# EAGLE design board (EAGLE 6.4)
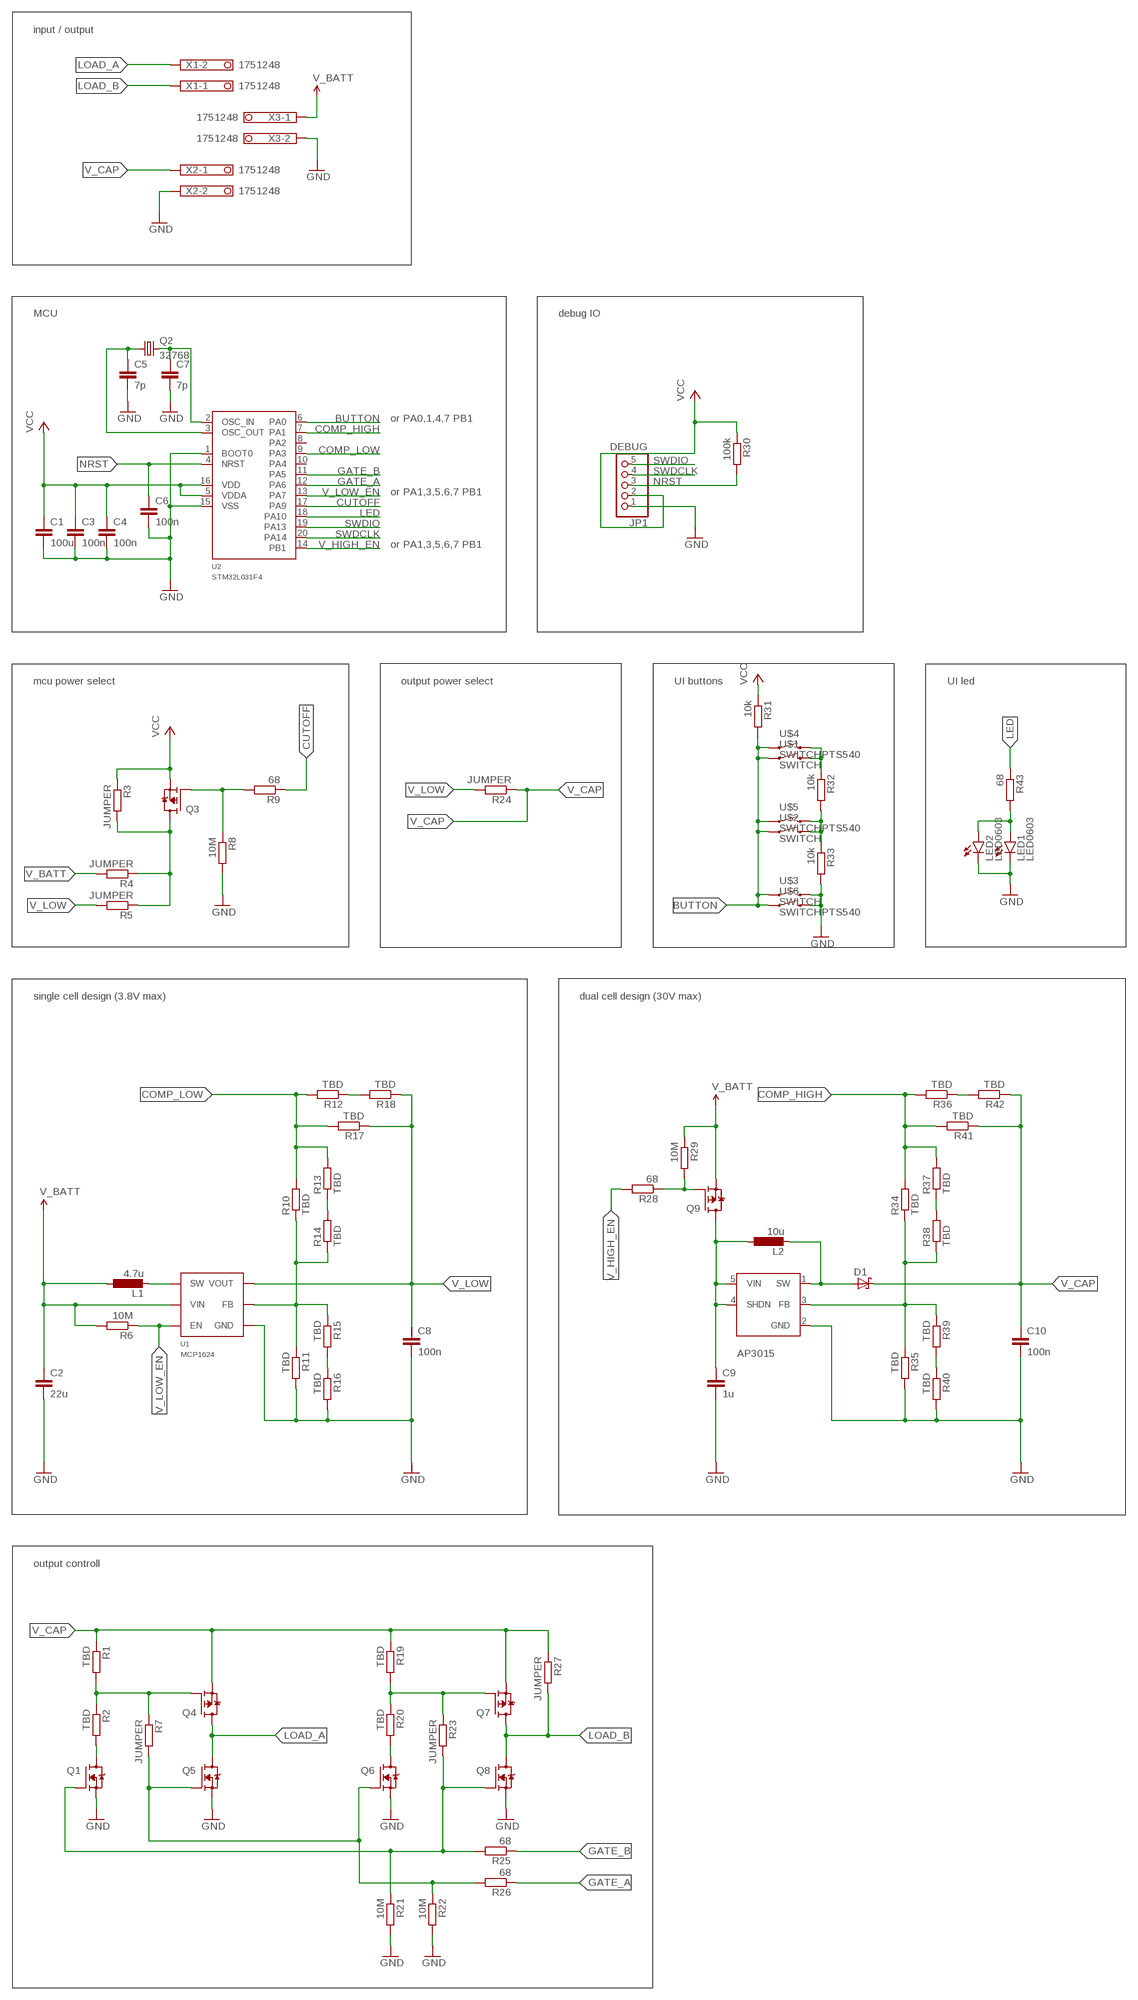
[diagram p0: schematic, sheet 1]

## Parts
C1  100u  CAPACITOR1206  [1206-SMALL]
C2  22u  CAPACITOR0805  [0805-SMALL]
C3  100n  CAPACITOR0603  [0603-SMALL]
C4  100n  CAPACITOR0603  [0603-SMALL]
C5  7p  C-EU0603-SAMLL  [0603-SMALL]
C6  100n  CAPACITOR0603  [0603-SMALL]
C7  7p  C-EU0603-SAMLL  [0603-SMALL]
C8  100n  CAPACITOR0603  [0603-SMALL]
C9  1u  CAPACITOR0805  [0805-SMALL]
C10  100n  CAPACITOR0603  [0603-SMALL]
D1  SCHOTTKY  [DO-214]
JP1  DEBUG  PINHD-1X05_2.54-S  [1X05-S]
L1  4.7u  INDUCTORSRN2510F  [SRN2510F]
L2  10u  INDUCTOR74404043100A  [74404043100A]
LED1  LED0603  [0603-SMALL]
LED2  LED0603  [0603-SMALL]
Q1  NFETGENERIC  [SOT23]
Q2  32768  ABS07  [ABS07]
Q3  PFETIRLML6401  [SOT23]
Q4  PFETIRLML6401  [SOT23]
Q5  NFETGENERIC  [SOT23]
Q6  NFETGENERIC  [SOT23]
Q7  PFETIRLML6401  [SOT23]
Q8  NFETGENERIC  [SOT23]
Q9  PFETIRLML6401  [SOT23]
R1  TBD  RESISTOR0603  [0603-SMALL]
R2  TBD  RESISTOR0603  [0603-SMALL]
R3  JUMPER  RESISTOR0603  [0603-SMALL]
R4  JUMPER  RESISTOR0603  [0603-SMALL]
R5  JUMPER  RESISTOR0603  [0603-SMALL]
R6  10M  RESISTOR0603  [0603-SMALL]
R7  JUMPER  RESISTOR0603  [0603-SMALL]
R8  10M  RESISTOR0603  [0603-SMALL]
R9  68  RESISTOR0603  [0603-SMALL]
R10  TBD  RESISTOR0603  [0603-SMALL]
R11  TBD  RESISTOR0603  [0603-SMALL]
R12  TBD  RESISTOR0603  [0603-SMALL]
R13  TBD  RESISTOR0603  [0603-SMALL]
R14  TBD  RESISTOR0603  [0603-SMALL]
R15  TBD  RESISTOR0603  [0603-SMALL]
R16  TBD  RESISTOR0603  [0603-SMALL]
R17  TBD  RESISTOR0603  [0603-SMALL]
R18  TBD  RESISTOR0603  [0603-SMALL]
R19  TBD  RESISTOR0603  [0603-SMALL]
R20  TBD  RESISTOR0603  [0603-SMALL]
R21  10M  RESISTOR0603  [0603-SMALL]
R22  10M  RESISTOR0603  [0603-SMALL]
R23  JUMPER  RESISTOR0603  [0603-SMALL]
R24  JUMPER  RESISTOR0603  [0603-SMALL]
R25  68  RESISTOR0603  [0603-SMALL]
R26  68  RESISTOR0603  [0603-SMALL]
R27  JUMPER  RESISTOR0603  [0603-SMALL]
R28  68  RESISTOR0603  [0603-SMALL]
R29  10M  RESISTOR0603  [0603-SMALL]
R30  100k  RESISTOR0603  [0603-SMALL]
R31  10k  RESISTOR0603  [0603-SMALL]
R32  10k  RESISTOR0603  [0603-SMALL]
R33  10k  RESISTOR0603  [0603-SMALL]
R34  TBD  RESISTOR0603  [0603-SMALL]
R35  TBD  RESISTOR0603  [0603-SMALL]
R36  TBD  RESISTOR0603  [0603-SMALL]
R37  TBD  RESISTOR0603  [0603-SMALL]
R38  TBD  RESISTOR0603  [0603-SMALL]
R39  TBD  RESISTOR0603  [0603-SMALL]
R40  TBD  RESISTOR0603  [0603-SMALL]
R41  TBD  RESISTOR0603  [0603-SMALL]
R42  TBD  RESISTOR0603  [0603-SMALL]
R43  68  RESISTOR0603  [0603-SMALL]
U1  MCP1624  [SOT23-6]
U2  STM32L031F4  [TSSOP20]
U3  AP3015  [SOT23-5]
U$1  SWITCH  [TACT-4.6X2.8]
U$2  SWITCH  [TACT-4.6X2.8]
U$3  SWITCH  [TACT-4.6X2.8]
U$4  SWITCHPTS540  [PTS540]
U$5  SWITCHPTS540  [PTS540]
U$6  SWITCHPTS540  [PTS540]
X1  1751248  [1751248]
X2  1751248  [1751248]
X3  1751248  [1751248]

## Nets
BUTTON: R31.2 U2.6(PA0) U$1.P$1 U$1.P$2 U$2.P$1 U$2.P$2 U$3.P$1 U$3.P$2 U$4.1 U$4.2 U$5.1 U$5.2 U$6.1 U$6.2
COMP_HIGH: R34.2 R36.2 R37.2 R41.2 U2.7(PA1)
COMP_LOW: R10.2 R12.2 R13.2 R17.2 U2.9(PA3)
CUTOFF: R9.1 U2.17(PA9)
GATE_A: R26.1 U2.12(PA6)
GATE_B: R25.1 U2.11(PA5)
GND: C1.2 C2.2 C3.2 C4.2 C5.2 C6.2 C7.2 C8.2 C9.2 C10.2 JP1.1 LED1.2(C) LED2.2(C) Q1.2(S) Q5.2(S) Q6.2(S) Q8.2(S) R8.2 R11.2 R16.2 R21.2 R22.2 R33.2 R35.2 R40.2 U1.2(GND) U2.1(BOOT0) U2.15(VSS) U3.2(GND) U$3.P$3 U$3.P$4 U$6.3 U$6.4 X2.2 X3.2
HBRIDGE_A: Q1.1(G) Q8.1(G) R21.1 R23.2 R25.2
HBRIDGE_B: Q5.1(G) Q6.1(G) R7.2 R22.1 R26.2
LED: R43.1 U2.18(PA10)
LOAD_A: Q4.3(D) Q5.3(D) X1.2
LOAD_B: Q7.3(D) Q8.3(D) R27.2 X1.1
N$1: C9.1 L2.P$1 Q9.3(D) U3.4(SHDN) U3.5(VIN)
N$2: R32.1 U$1.P$3 U$1.P$4 U$4.3 U$4.4
N$3: L1.P$2 U1.1(SW)
N$4: R32.2 R33.1 U$2.P$3 U$2.P$4 U$5.3 U$5.4
N$5: Q3.1(G) R8.1 R9.2
N$6: D1.P$1(A) L2.P$2 U3.1(SW)
N$7: R10.1 R11.1 R14.1 R15.1 U1.4(FB)
N$10: LED1.1(A) LED2.1(A) R43.2
N$11: C7.1 Q2.P$2 U2.2(OSC_IN)
N$12: R13.1 R14.2
N$14: C5.1 Q2.P$1 U2.3(OSC_OUT)
N$15: R15.2 R16.1
N$16: R12.1 R18.2
N$17: R39.2 R40.1
N$18: R36.1 R42.2
N$19: Q9.1(G) R28.1 R29.2
N$20: R37.1 R38.2
N$21: R34.1 R35.1 R38.1 R39.1 U3.3(FB)
N$22: Q3.3(D) R3.2 R4.1 R5.1
N$23: Q4.1(G) R1.2 R2.1 R7.1
N$24: Q7.1(G) R19.2 R20.1 R23.1
N$25: Q1.3(D) R2.2
N$26: Q6.3(D) R20.2
NRST: C6.1 JP1.3 R30.2 U2.4(NRST)
SWDCLK: JP1.4 U2.20(PA14)
SWDIO: JP1.5 U2.19(PA13)
V_BATT: C2.1 L1.P$1 Q9.2(S) R4.2 R6.2 R29.1 U1.6(VIN) X3.1
V_CAP: C10.1 D1.P$2(C) Q4.2(S) Q7.2(S) R1.1 R19.1 R24.1 R27.1 R41.1 R42.1 X2.1
V_HIGH_EN: R28.2 U2.14(PB1)
V_LOW: C8.1 R5.2 R17.1 R18.1 R24.2 U1.5(VOUT)
V_LOW_EN: R6.1 U1.3(EN) U2.13(PA7)
VCC: C1.1 C3.1 C4.1 JP1.2 Q3.2(S) R3.1 R30.1 R31.1 U2.5(VDDA) U2.16(VDD)
Unconnected: U2.8(PA2) U2.10(PA4)

## Notes on the sheet
- input / output
- MCU | debug IO
- or PA0,1,4,7 PB1
- or PA1,3,5,6,7 PB1
- or PA1,3,5,6,7 PB1
- mcu power select | output power select | UI buttons | UI led
- single cell design (3.8V max) | dual cell design (30V max)
- output controll

## Library data of the parts
C1-C4 C6 C8-C10 = crap:CAPACITOR
C5 C7 = resistor:C-EU: CAPACITOR, European symbol
D1 = crap:SCHOTTKY
JP1 = pinhead-2:PINHD-1X05: PIN HEADER
L1 L2 = crap:INDUCTOR
LED1 LED2 = crap:LED
Q1 Q5 Q6 Q8 = crap:NFET
Q2 = crap:ABS07
Q3 Q4 Q7 Q9 = crap:PFET
R1-R43 = crap:RESISTOR
U1 = crap:MCP1624
U2 = crap:STM32L031F4
U3 = crap:AP3015
U$1-U$6 = crap:SWITCH
X1-X3 = con-phoenix-350:1751248: MKDS 1/ 2-3,5 Printklemme Nennstrom: 10 A Bemessungsspannung: 160 V Raster: 3,5 mm Polzahl: 2 Montageart: Löten Anschlussart: Schraubanschluss Anschlussrichtung vom Leiter zur Platine: 0° Source: http://eshop.phoenixcontact.com .. 1751248.pdf; OC_FARNELL: unknown; OC_NEWARK: unknown

## Board
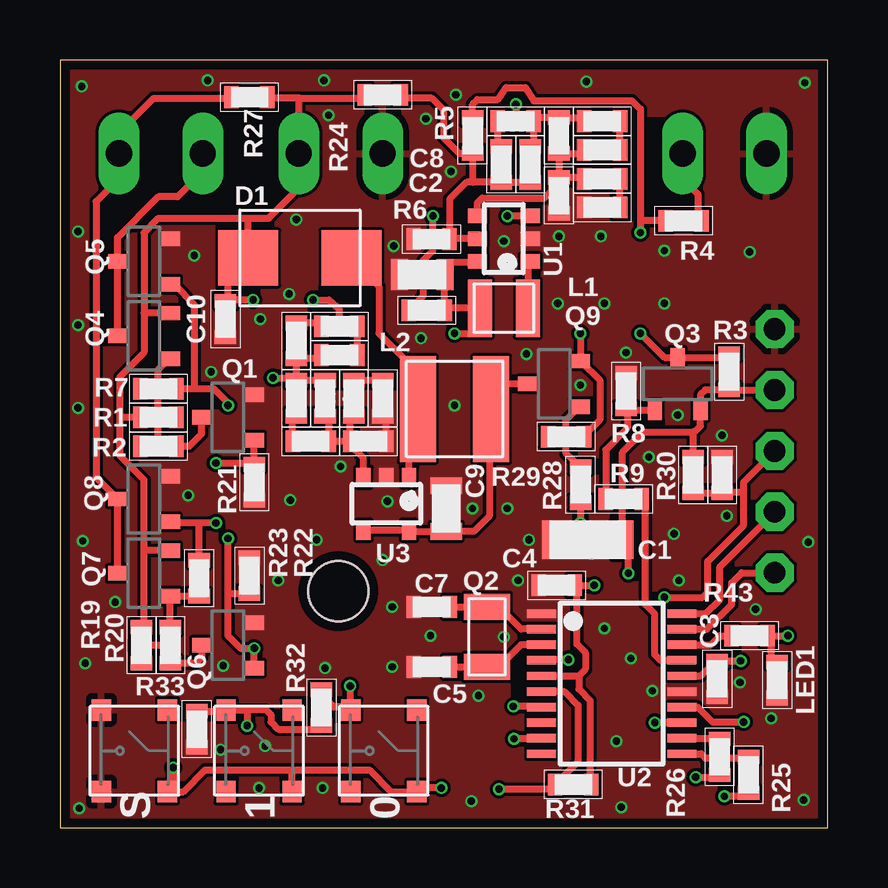
[diagram p1: board, top side]
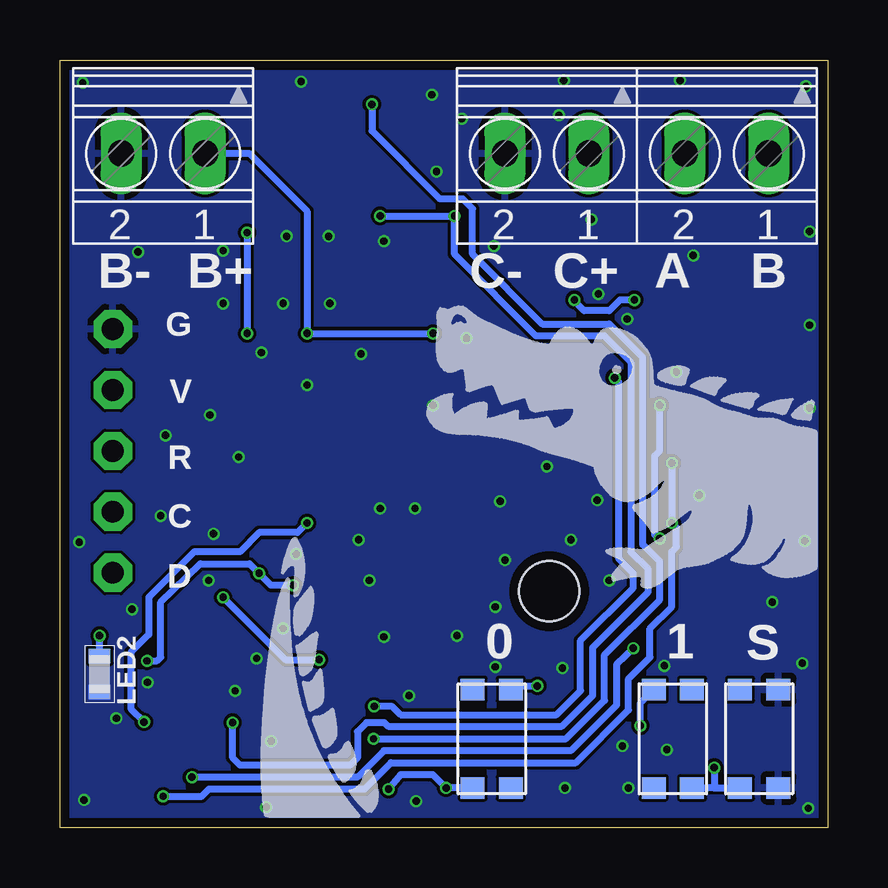
[diagram p2: board, bottom side, seen from below]

Size 32 x 32 mm. Coordinates in mm from the lower left corner, seen from the top.
Outline: 0,0 32,0 32,32 0,32 0,0
Copper layers (1*16): Top 0.035559375mm / dielectric 1.6mm / Bottom 0.035559375mm
Design rules "jlcpcb2layerv2 *": minimum track width 5mil, minimum drill 0.3mm, track to track 5mil, track to pad 0.2mm, pad to pad 5mil, via to via 10mil, smd to smd 5mil, copper to edge 0.4mm, drill to drill 0.5mm, minimum pad ring 5mil, minimum via ring 3mil, stop-mask expansion 1.5mil, vias tented up to drill 0.3mm, thermal gap 10mil
Holes 2.5 mm at 11.6,9.85
tRestrict: area 18.8,5.5 to 19.3,6; area 28.7,2 to 29.2,2.5; area 22.4,26.5 to 22.9,27; area 25.8,24.8 to 26.2,25.3; area 10.2,15.6 to 10.7,16.1; area 9.3,20.1 to 9.8,20.6; area 21.1,1.3 to 21.6,1.8; area 7.7,30.4 to 8.2,30.9; area 15.1,21.1 to 15.6,21.6; area 24.6,29.1 to 25.1,29.6; area 3.8,15.3 to 4.3,15.8; area 2.8,7.3 to 3.3,7.8

### Footprints (pad centres in the part's own frame; a part is rotated, then mirrored left to right if it is on the bottom)
1206-SMALL = smd 0.9 x 1.6: 1 -1.45,0; 2 1.45,0
0805-SMALL = smd 0.7 x 1.3: 1 -0.95,0; 2 0.95,0
0603-SMALL = smd 0.6 x 0.9: 1 -0.75,0; 2 0.75,0
DO-214 = smd 2.5 x 2.3: P$1 -2.15,0; P$2 2.15,0
1X05-S = drill 0.9 pad 1.6 octagon: 1 -5.08,0; 2 -2.54,0; 3 0,0; 4 2.54,0; 5 5.08,0
SRN2510F = smd 1 x 2.4: P$1 -1,0; P$2 1,0
74404043100A = smd 4.4 x 1.5: P$1 0,1.525; P$2 0,-1.525
SOT23 = smd 0.6 x 0.8: 1 -0.95,-1.1; 2 0.95,-1.1; 3 0,1.1
ABS07 = smd 1.1 x 1.9: P$1 -1.25,0; P$2 1.25,0
SOT23-6 = smd 0.6 x 0.8: 1 -0.95,-1.1; 2 0,-1.1; 3 0.95,-1.1; 4 0.95,1.1; 5 0,1.1; 6 -0.95,1.1
TSSOP20 = smd 0.35 x 1.2: 1 -2.925,-2.925; 2 -2.275,-2.925; 3 -1.625,-2.925; 4 -0.975,-2.925; 5 -0.325,-2.925; 6 0.325,-2.925; 7 0.975,-2.925; 8 1.625,-2.925; 9 2.275,-2.925; 10 2.925,-2.925; 11 2.925,2.925; 12 2.275,2.925; 13 1.625,2.925; 14 0.975,2.925; 15 0.325,2.925; 16 -0.325,2.925; 17 -0.975,2.925; 18 -1.625,2.925; 19 -2.275,2.925; 20 -2.925,2.925
SOT23-5 = smd 0.6 x 0.8: 1 -0.95,-1.1; 2 0,-1.1; 3 0.95,-1.1; 4 0.95,1.1; 5 -0.95,1.1
TACT-4.6X2.8 = smd 0.9 x 1: P$1 -2.05,-0.8; P$2 2.05,-0.8; P$3 -2.05,0.8; P$4 2.05,0.8
PTS540 = smd 0.9 x 0.8: 1 -1.7,1.375; 2 1.7,1.375; 3 -1.7,-1.375; 4 1.7,-1.375
1751248 = drill 1.1 pad 1.7 long: 1 -1.75,-0.1; 2 1.75,-0.1

### Placement (x,y rotation side)
C1  22,12 180 top
C2  15.1,23.05 180 top
C3  27.4,6.2 270 top
C4  20.7,10.1 180 top
C5  15.5,6.7 180 top
C6  27.6,14.7 90 top
C7  15.5,9.2 180 top
C8  15.49,24.53 180 top
C9  16.1,13.3 90 top
C10  6.9,21.2 270 top
D1  10,23.75 180 top
JP1  29.8,15.7 270 top
L1  18.5,21.65 0 top
L2  16.45,17.45 270 top
LED1  29.9,6.15 270 top
LED2  30.35,6.4 270 bottom
Q1  7,17.1 90 top
Q2  17.8,7.95 90 top
Q3  25.75,18.5 0 top
Q4  3.5,20.5 90 top
Q5  3.5,23.6 90 top
Q6  7,7.6 90 top
Q7  3.5,10.6 90 top
Q8  3.5,13.7 90 top
Q9  20.6,18.5 90 top
R1  4.1,17.1 0 top
R2  4.1,15.9 0 top
R3  27.9,19 90 top
R4  26,25.3 0 top
R5  17.2,28.85 270 top
R6  15.29,21.56 0 top
R7  4.1,18.3 0 top
R8  23.6,18.2 90 top
R9  23.5,13.7 180 top
R10  20.8,28.85 90 top
R11  20.8,26.35 270 top
R12  19,29.45 0 top
R13  22.6,29.45 180 top
R14  22.6,28.25 0 top
R15  22.6,27.05 0 top
R16  22.6,25.85 180 top
R17  19.6,27.65 90 top
R18  18.4,27.65 90 top
R19  3.4,7.6 270 top
R20  4.6,7.6 270 top
R21  8.1,14.4 270 top
R22  7.9,10.5 90 top
R23  5.8,10.4 90 top
R24  13.45,30.55 0 top
R25  28.7,2.2 270 top
R26  27.5,2.95 270 top
R27  7.9,30.45 180 top
R28  21.7,14.3 270 top
R29  21.1,16.3 180 top
R30  26.4,14.7 270 top
R31  21.4,1.8 180 top
R32  10.9,5 270 top
R33  5.7,4.1 270 top
R34  11.05,17.9 90 top
R35  12.85,16.1 0 top
R36  9.85,20.3 270 top
R37  9.85,17.9 90 top
R38  10.45,16.1 180 top
R39  12.25,17.9 90 top
R40  13.45,17.9 270 top
R41  11.65,19.7 180 top
R42  11.65,20.9 180 top
R43  28.75,8 0 top
U1  18.5,24.55 90 top
U2  23,6 270 top
U3  13.6,13.5 180 top
U$1  14,3.7 270 bottom
U$2  6.45,3.7 90 bottom
U$3  2.85,3.7 270 bottom
U$4  13.5,3.2 270 top
U$5  8.3,3.2 270 top
U$6  3.1,3.2 270 top
X1  4.2,28 180 bottom
X2  11.7,28 180 bottom
X3  27.7,28 180 bottom

### Tracks (layer width: path | path; a pad name or v marks a point on that pad's centre or on a via)
BUTTON  (via drill 0.3 pad 0.5)
  Top 0.3: 4.72,1.5 5.15,1.5 6.05,2.4 9.8,2.4 | 9.8,2.4 12.9,2.4 13.8,1.5 U$4.2 14.97,1.65 v15.9,1.65 | U$5.2 9.68,2.27 9.8,2.4 | U2.6 21.02,5.67 21.6,5.1 21.6,2.75 R31.2 20.75,1.6 v18.3,1.6 | 4.47,4.75 U$6.1 | v4.72,2.5 4.72,1.5 | 4.72,1.5 U$6.2
  Bottom 0.3: v18.3,1.6 17.8,2.2 16.45,2.2 v15.9,1.65 U$1.P$2 | U$3.P$1 3.55,5.75 | U$2.P$1 5,1.65 4.72,1.65 | 4.72,1.65 U$3.P$2 | v4.72,2.5 4.72,1.65
COMP_HIGH  (via drill 0.3 pad 0.5)
  Top 0.3: R41.2 10.75,19.55 R36.2 R37.2 | R37.2 R34.2 | U2.7 20.05,5 20,5.05 v18.9,5.05 | 9.85,18.75 R37.2 | 9.65,18.65 R37.2 | v8.88,18.75 9.75,18.75 R37.2
  Bottom 0.3: v18.9,5.05 18.15,5.05 17.8,4.7 11.3,4.7 10.3,5.7 10.3,7.8 8.1,10 8.1,10.6 8.7,11.2 8.7,18.57 v8.88,18.75
COMP_LOW  (via drill 0.3 pad 0.5)
  Top 0.3: R12.2 19.75,29.6 R10.2 21.85,29.6 R13.2 | R17.2 19.75,28.4 R12.2 | U2.9 20.05,3.7 v18.93,3.7 | v19,30.15 19,29.7 19.25,29.45 R12.2
  Bottom 0.3: v18.93,3.7 10.9,3.7 9.3,5.3 9.3,7.2 7,9.5 7,11.1 7.7,11.8 7.7,19.6 9.1,21 11.9,21 14.8,23.9 14.8,25.8 15.2,26.2 16.15,26.2 19,29.05 v19,30.15
CUTOFF
  Top 0.3: U2.17 25.02,6.97 24.8,7.2 24.8,8.9 24.4,9.3 24.4,13.55 R9.1
GATE_A
  Top 0.3: U2.12 27.38,3.73 R26.1
GATE_B
  Top 0.3: 28.57,3.08 R25.1 28.65,2.9 26.9,2.9 26.73,3.08 U2.11
GND  (via drill 0.3 pad 0.5)
  Top 0.3: R35.2 13.6,17.15 R40.2 | 21.85,25.6 R16.2
  other vias: 13.85,6.7 13.85,9.2 18.5,7.95 15.45,8 17.45,5.5 19.55,12 19.1,10.3 28.35,6.05 29.65,4.55 24.7,5.7 23.6,19.8 27.6,16.35 25.6,12.25 24.55,15.45 25.75,17.2 18.5,24.45 20.8,24.65 22.55,24.65 20.75,21.85 22.7,21.85 25.2,21.85 25.2,24.05 13.65,13.6 17.2,13.3 18.65,13.3 5.6,23.85 5.35,13.85 9.6,13.65 6.8,6.75 9.1,10.3 8.55,3.4 11.05,6.65 17.15,1.1 23.2,3.6 23.4,0.85 8.35,21.2 6.3,19 9.85,25.35 11,31.15 16.3,27.35 16.5,30.55 21.95,31.1 31,1.15 0.8,0.8 6.7,3.25 1.05,6.85 0.95,11.95 2.3,9.4 0.75,17.5 0.75,20.95 0.75,24.85 0.9,30.9 6.15,31.15 31.2,11.9 10.7,12 16.45,17.6 15.05,20.4 13.91,24.25 23.8,7.05 22.7,8.3 22.15,11.4 31.05,31.05 28.75,24 11.7,15.05 15.25,29.55 11.2,29.7 19.45,19.75 21.7,18.45 25.8,10.3 27.8,13 29,9.1 10.95,1.65 8.3,1.65 9.55,22.25 13.45,11.15
  pour Top (isolate 0.013, no thermals): 0,5.8 0,32 11.3,31.95 11.3,25.5 15.15,25.55 15.15,31.95 27.7,32 27.7,25.5 32,25.5 32,22.5 28.5,22.5 28.5,19.5 32,19.5 32,0 3.5,0 3.5,5.8
  pour Top (isolate 0.013): 27.7,32 32.05,32 32,25.55 27.7,25.5
  pour Top (isolate 0.013): 28.5,22.5 32,22.5 31.95,19.55 28.5,19.55
  pour Top (isolate 0.013): 0,5.8 3.55,5.8 3.5,0 0,0
  pour Top (isolate 0.013): 11,32 15.2,32 15.3,25.5 10.9,25.5
  pour Bottom (isolate 0.013, no thermals): 4,0 4,7.5 0,7.5 0,32 11.3,31.95 11.3,25.5 15.15,25.55 15.15,31.95 27.7,32 27.7,25.5 32,25.5 32,22.5 28.5,22.5 28.5,19.5 32,19.5 32,0
  pour Bottom (isolate 0.013): 11.15,31.95 15.35,31.95 15.45,25.45 11.05,25.45
  pour Bottom (isolate 0.013): 28.5,22.5 32,22.5 31.95,19.55 28.5,19.55
  pour Bottom (isolate 0.013): 27.7,32 32.05,32 32,25.55 27.7,25.5
  pour Bottom (isolate 0.013): 0,7.55 4.05,7.55 4,0 0,0
HBRIDGE_A  (via drill 0.3 pad 0.5)
  Top 0.3: v6.5,12.7 5.8,12.7 | 5.8,12.7 4.65,12.7 Q8.1 | R23.2 5.8,12.7 | R25.2 28.55,1.3 v27.7,1.3 | 8.05,15.1 arc90 R21.1 | v6.5,15.2 8.05,15.2 R21.1 | R21.1 Q1.1
  Bottom 0.3: v6.5,15.2 v6.5,12.7 6.3,12.5 6.3,11.7 6.5,11.5 6.5,9.2 7.4,8.3 7.4,7.1 8.3,6.2 8.3,4.9 10.5,2.7 18.2,2.7 19.3,1.6 25.8,1.6 26.1,1.3 v27.7,1.3
HBRIDGE_B  (via drill 0.3 pad 0.5)
  Top 0.3: 7,9.75 7,8 7.53,7.47 v8.1,7.47 Q6.1 | 7,9.75 v7,12.05 | R22.1 7,9.75 | v7,17.6 7,17.7 6.4,18.3 5.6,18.3 | Q5.1 4.75,22.65 5.6,21.8 5.6,18.3 | R7.2 5.6,18.3 | v26.5,2.1 27.5,2.1 R26.2
  Bottom 0.3: v8.1,7.47 8.8,6.8 8.8,5.1 10.7,3.2 18.5,3.2 19.6,2.1 v26.5,2.1 | v7,12.05 7.2,12.2 7.2,15.5 7,15.7 v7,17.6
LED
  Top 0.3: U2.18 27.12,7.62 27.5,8 R43.1
LOAD_A
  Top 0.3: Q4.3 Q5.3 2.4,24.6 4.1,26.3 4.9,26.3 5.95,27.35 X1.2
LOAD_B
  Top 0.3: 2.35,10.65 Q7.3 Q8.3 1.5,14.6 1.5,26.1 2.45,27.05 X1.1 2.45,28.95 3.9,30.4 7.15,30.4 R27.2
N$1
  Top 0.3: 17.6,17.5 L2.P$1 | L2.P$1 18.3,17.23 18.3,15.9 17.9,15.8 17.9,13 17.25,12.35 C9.1 14.6,12.35 U3.5 U3.4 | Q9.3 18.02,18.5 L2.P$1
N$2  (via drill 0.3 pad 0.5)
  Top 0.3: 12.07,4.85 U$4.3 | 12,5.03 U$4.3 | 12,5.03 12.3,5.03 | 12,5.03 11.43,5.03 11.2,5.25 11.2,5.75 R32.1 | v12.1,5.9 12.1,4.9 U$4.3
  Bottom 0.3: 13.3,6.05 U$1.P$3 13.2,5.9 v12.1,5.9
N$3
  Top 0.3: U1.1 19.5,23.6 L1.P$2
N$4  (via drill 0.3 pad 0.5)
  Top 0.3: R33.1 6.88,4.85 U$5.3 | U$5.3 8.6,4.9 8.8,4.7 8.8,4.4 9.1,4.1 10.75,4.1 R32.2 | U$5.3 7.8,4.9 v7.8,4.25
  Bottom 0.3: v7.8,4.25 7.8,5.2 U$2.P$4
N$5
  Top 0.3: R8.1 23.65,17.4 | 23.65,17.4 Q3.1 | 23.65,17.4 23.65,16.65 22.75,15.75 R9.2
N$6
  Top 0.3: 15.4,17.5 L2.P$2 | D1.P$1 13.3,22.55 13.3,20.6 14.97,18.93 L2.P$2 | U3.1 14.55,17.5 L2.P$2
N$7
  Top 0.3: 21.85,27.2 R15.1 21.75,27.15 21.75,27.1 R11.1 | R11.1 R10.1 21.85,28.1 R14.1 | 20.6,27.2 R11.1 | U1.4 17.4,26.05 17.6,26.25 20.2,26.25 20.5,26.55 20.5,27.15 R11.1
N$10  (via drill 0.3 pad 0.5)
  Top 0.3: LED1.1 29.9,7.05 29.65,7.05 29.65,8 | 29.65,8 R43.2 | 29.65,8 v30.35,8
  Bottom 0.3: LED2.1 v30.35,8
N$11
  Top 0.3: U2.2 19.23,8.28 18.25,9.25 Q2.P$2 C7.1
N$12
  Top 0.3: R14.2 R13.1
N$14
  Top 0.3: U2.3 19.23,7.62 18.35,6.75 Q2.P$1 C5.1
N$15
  Top 0.3: R16.1 R15.2
N$16
  Top 0.3: R18.2 18.25,28.4 R12.1
N$17
  Top 0.3: R39.2 R40.1
N$18
  Top 0.3: R36.1 10.9,21.05 R42.2
N$19
  Top 0.3: R28.1 21.4,15.3 21.1,15.6 21.1,16.3 | 21.1,16.3 21.1,17 21.5,17.4 arc-16 Q9.1 | R29.2 21.1,16.3
N$20
  Top 0.3: R38.2 9.7,17.15 R37.1
N$21
  Top 0.3: R35.1 12.1,17.15 R39.1 | R34.1 11.2,17.15 R38.1 R35.1 | U3.3 12.65,15.4 12.1,15.95 R35.1
N$22  (via drill 0.3 pad 0.5)
  Top 0.3: R3.2 27.95,19.6 Q3.3 25.2,19.6 v24.2,20.6 | R5.1 17.2,30.15 17.4,30.35 18.25,30.35 18.6,30.85 19.4,30.85 19.75,30.3 23.85,30.3 24.2,29.95 24.2,25.3 | 24.2,25.3 v24.2,24.8 | R4.1 24.2,25.3
  Bottom 0.3: v24.2,24.8 v24.2,20.6
N$23
  Top 0.3: Q4.1 4.7,19.45 4.45,19.45 4.1,19.1 4.1,18.3 | R1.2 4.7,17.2 4.1,17.2 | R7.1 4.1,18.3 | 4.1,17.2 4.1,18.3 | R2.1 3.35,15.95 3.85,15.95 4.1,16.2 4.1,17.2
N$24
  Top 0.3: R23.1 Q7.1 R20.1 4.6,7.8 4.4,7.6 3.7,7.6 3.4,7.3 R19.2
N$25
  Top 0.3: R2.2 5.4,15.9 5.9,16.4 Q1.3
N$26
  Top 0.3: Q6.3 5.9,7.1 5.65,6.85 R20.2
NRST  (via drill 0.3 pad 0.5)
  Top 0.3: v25.2,9.6 26.8,9.6 27,9.8 27,11.1 28.5,12.6 28.5,14 | 28.5,14 28.5,14.4 JP1.3 | R30.2 C6.1 27.6,14 28.5,14 | v21.2,7 20.1,7 U2.4
  Bottom 0.3: v25.2,9.6 22.6,7 v21.2,7
SWDCLK
  Top 0.3: U2.20 26.93,8.93 27.5,9.5 27.5,10.86 JP1.4
SWDIO
  Top 0.3: U2.19 26.98,8.28 28,9.3 28,10.2 28.42,10.62 JP1.5
V_BATT  (via drill 0.3 pad 0.5)
  Top 0.3: U1.6 17.2,23.6 17.2,23.55 16.05,23.55 C2.1 R6.2 16.13,21.65 L1.P$1 17.5,20.6 v16.45,20.6 | R29.1 21.85,16.35 22.5,17 22.5,18.65 Q9.2 v21.7,20.6 | R4.2 26.6,25.45 26.6,26.4 25.95,27.05 X3.1
  Bottom 0.3: v16.45,20.6 v21.7,20.6 21.7,25.7 24.1,28.1 X3.1
V_CAP  (via drill 0.3 pad 0.5)
  Top 0.3: 3.5,11.55 3.5,8.45 R19.1 | Q7.2 3.5,11.55 | 3.5,11.55 3.5,14.5 2.5,15.5 2.5,17.1 | 2.5,17.1 2.5,18.8 3.5,19.8 3.5,21.45 | R1.1 2.5,17.1 | 3.5,21.45 3.5,24.8 4.1,25.4 7.85,25.4 | Q4.2 3.5,21.45 | 7.85,25.4 8.7,25.4 9.95,26.65 X2.1 9.95,30.35 10,30.4 | D1.P$2 7.85,25.4 | 7.6,23 7.8,23.5 D1.P$2 | R41.1 R42.1 11.85,20.9 11.65,21.1 11.65,21.6 11.2,22 v10.55,22 | 7.9,23.7 D1.P$2 | D1.P$2 7.65,23.5 7,23.5 7,21.95 C10.1 6.95,22 v8.05,22 | 10,30.4 8.65,30.4 R27.1 | 10,30.4 12.7,30.4 R24.1
  Bottom 0.3: v8.05,22 8.65,22 9.1,21.55 10.15,21.55 10.55,21.95 v10.55,22
V_HIGH_EN  (via drill 0.3 pad 0.5)
  Top 0.3: R28.2 v21.7,12.7 | U2.14 26.57,5.03 27.2,4.4 v28.5,4.4
  Bottom 0.3: v21.7,12.7 22.1,12.3 23.7,12.3 24.5,11.5 26.4,11.5 28.3,9.6 28.3,8.05 29.05,7.3 29.05,4.95 v28.5,4.4
V_LOW
  Top 0.3: R17.1 R18.1 17.2,26.9 | U1.5 16.09,24.55 C8.1 16.24,26.19 16.95,26.9 17.2,26.9 | 17.2,26.9 R5.2 16.65,28.1 16,28.75 16,29.9 15.5,30.4 14.2,30.4 R24.2
V_LOW_EN  (via drill 0.3 pad 0.5)
  Top 0.3: U1.3 v18.65,25.5 | U2.13 v24.8,4.38 | 14.7,21.52 R6.1 15.15,22.17 15.15,23.65 15.55,24.05 v15.55,25.5
  Bottom 0.3: v18.65,25.5 v15.55,25.5 15.55,23.9 12.15,20.5 9.3,20.5 8.2,19.4 8.2,11.5 7.5,10.8 7.5,9.8 9.8,7.5 9.8,5.5 11.1,4.2 18.3,4.2 18.48,4.38 19.23,4.38 19.6,4 19.6,2.9 19.9,2.6 24.5,2.6 24.8,2.9 v24.8,4.38
VCC  (via drill 0.3 pad 0.5)
  Top 0.3: U2.5 21.62,6.33 | C1.1 23.55,12.05 23.5,12.5 | 21.62,6.33 21.62,5.78 22.1,5.3 22.1,1.85 R31.1 | U2.16 26.73,6.33 27.35,6.95 C3.1 v28.38,6.95 | 23.45,11.95 C1.1 | 21.62,6.33 21.9,6.6 21.9,7.3 21.55,7.65 21.55,10.1 C4.1 v22.27,10.1 | v23.7,10.6 23.7,11.75 C1.1 | C1.1 23.45,15.65 24.3,16.5 26.4,16.5 | 26.4,16.5 26.45,16.5 26.7,16.75 Q3.2 26.7,18.05 26.9,18.25 R3.1 28.11,18.24 JP1.2 | R30.1 26.4,16.5
  Bottom 0.3: v28.38,6.95 27.95,6.95 27.8,7.1 27.8,9.4 26.15,11 24.1,11 v23.7,10.6 23.2,10.1 v22.27,10.1

### Text on the board
tNames: h | M | m | m | h | H | l | L | l | h | h | H | m | M | l | l | m | L | S | 1 | 0
bNames: B | A | C+ | C- | B+ | B- | G | V | R | C | D | 1 | 0 | S